# Altium schematic sheet CommitV1.0.SchDoc
size A4
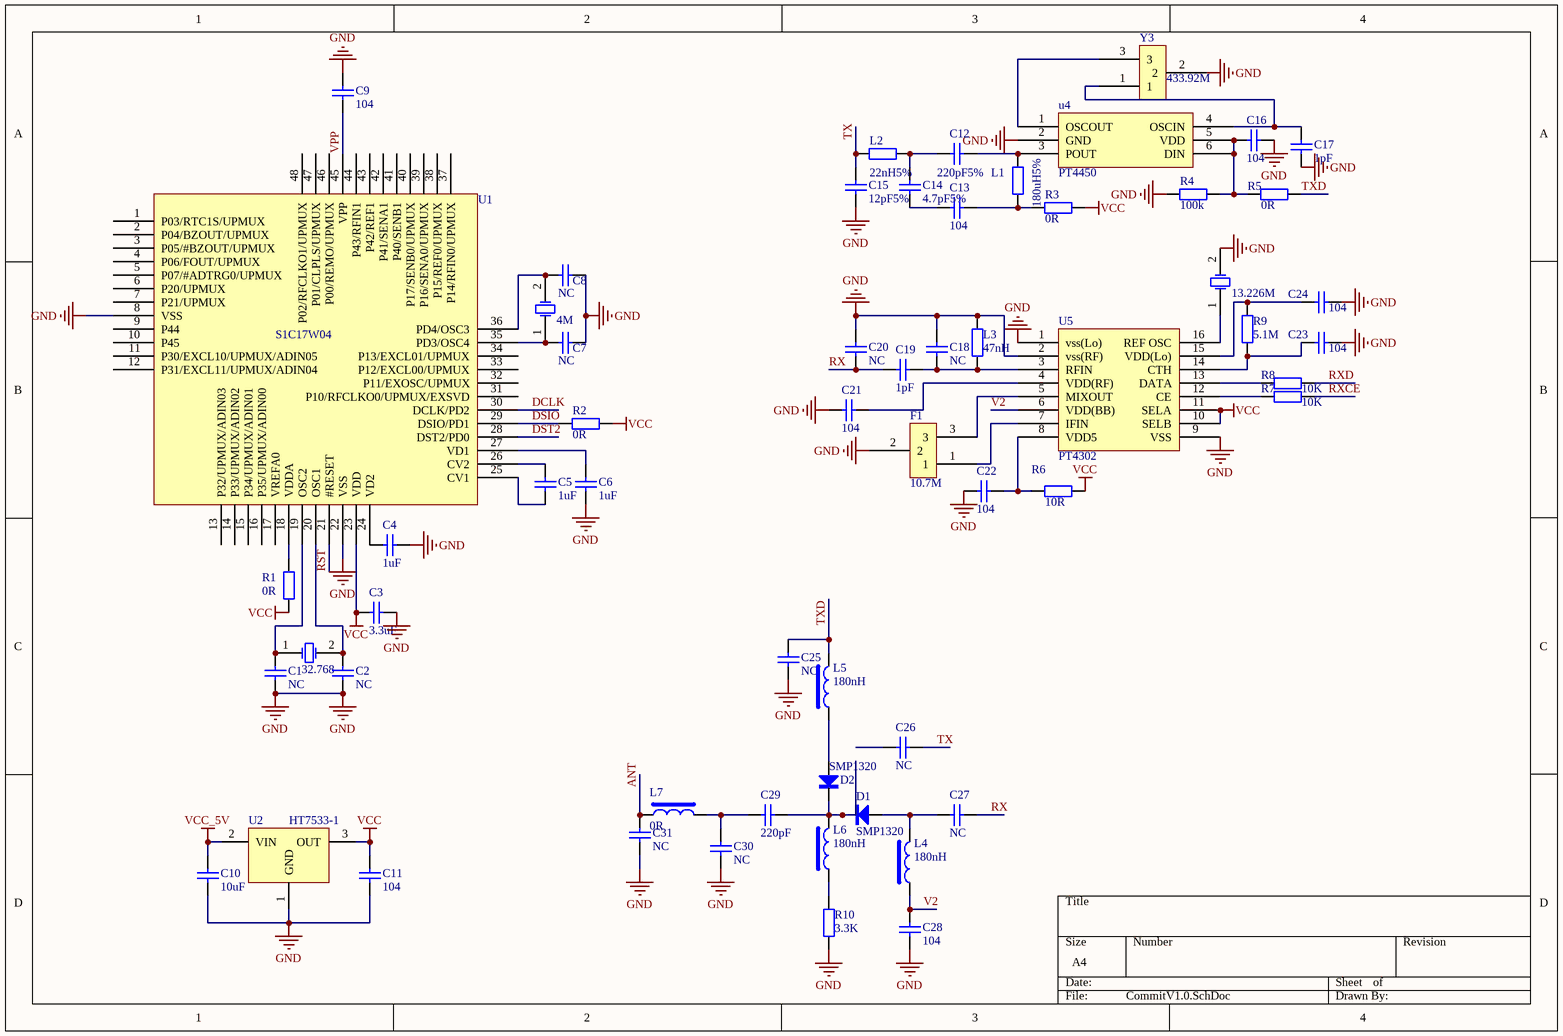
[diagram p0: CommitV1.0.SchDoc]

## Parts
C1  NC  [0603]
C2  NC  [0603]
C3  3.3uF  [0603]
C4  1uF  [0603]
C5  1uF  [0603]
C6  1uF  [0603]
C7  NC  [0603]
C8  NC  [0603]
C9  104  [0603]
C10  10uF  [0603]
C11  104  [0603]
C12  220pF5%  [0603]
C13  104  [0603]
C14  4.7pF5%  [0603]
C15  12pF5%  [0603]
C16  104  [0603]
C17  1pF  [0603]
C18  NC  [0603]
C19  1pF  [0603]
C20  NC  [0603]
C21  104  [0603]
C22  104  [0603]
C23  104  [0603]
C24  104  [0603]
C25  NC  [0603]
C26  NC  [0603]
C27  NC  [0603]
C28  104  [0603]
C29  220pF  [0603]
C30  NC  [0603]
C31  NC  [0603]
D1  SMP1320  [0603]
D2  SMP1320  [0603]
F1  10.7M  [PT4450 XTAL]
L1  180uH5%  [0603]
L2  22nH5%  [0603]
L3  47nH  [0603]
L4  180nH  [0603]
L5  180nH  [0603]
L6  180nH  [0603]
L7  0R  [0603]
R1  0R  [0603]
R2  0R  [0603]
R3  0R  [0603]
R4  100k  [0603]
R5  0R  [0603]
R6  10R  [0603]
R7  10K  [0603]
R8  10K  [0603]
R9  5.1M  [0603]
R10  3.3K  [0603]
U1  S1C17W04
U2  HT7533-1  [3A5A3D]
u4  PT4450  [PT4450]
U5  PT4302  [PT4302]
Y1  32.768  [XTAL-FC135]
Y2  4M
Y3  433.92M
Y4  13.226M  [PT4306 XTAL]

## Nets
GND: C1.1 C2.1 C3.1 C4.2 C6.2 C7.1 C8.1 C9.2 C10.2 C11.2 C15.1 C16.1 C17.2 C18.1 C20.2 C21.2 C22.2 C23.1 C24.1 C25.2 C28.1 C30.2 C31.2 F1.2 L3.2 R4.2 R10.2 U1.8(VSS) U1.22(VSS) U2.1(GND) u4.2(GND) U5.1(vss(Lo)) U5.2(vss(RF)) U5.9(VSS) Y3.2 Y4.2(OSC2)
VCC: C3.2 C11.1 R1.2 R2.1 R3.1 R6.1 U1.23(VDD) U2.3(OUT) U5.10(SELB) U5.11(SELA)
VCC_5V: C10.1 U2.2(VIN)
ANT: C31.1 L7.1
DCLK: U1.30(DCLK/PD2)
DSIO: R2.2 U1.29(DSIO/PD1)
DST2: U1.28(DST2/PD0)
RST: U1.21(#RESET)
RX: C19.1 C20.1 C27.2
RXCE: R7.1
RXD: R8.1
TX: C15.2 C26.2 L2.1
TXD: C25.1 L5.2 R5.1
V2: C28.2 L4.1 U5.6(VDD(BB))
VPP: C9.1 U1.45(VPP)
NetC1_2: C1.2 U1.19(OSC2) Y1.1(OSC1)
NetC2_2: C2.2 U1.20(OSC1) Y1.2(OSC2)
NetC4_1: C4.1 U1.24(VD2)
NetC5_1: C5.1 U1.25(CV1)
NetC5_2: C5.2 U1.26(CV2)
NetC6_1: C6.1 U1.27(VD1)
NetC7_2: C7.2 U1.35(PD3/OSC4) Y2.1(OSC1)
NetC8_2: C8.2 U1.36(PD4/OSC3) Y2.2(OSC2)
NetC12_1: C12.1 C14.2 L2.2
NetC12_2: C12.2 L1.1 u4.3(POUT)
NetC13_1: C13.1 C14.1
NetC13_2: C13.2 L1.2 R3.2
NetC16_2: C16.2 R4.1 R5.2 u4.5(VDD) u4.6(DIN)
NetC17_1: C17.1 u4.4(OSCIN) Y3.1
NetC18_2: C18.2 C19.2 L3.1 U5.3(RFIN)
NetC21_1: C21.1 U5.4(VDD(RF))
NetC22_1: C22.1 R6.2 U5.8(VDD5)
NetC23_2: C23.2 R9.2 U5.14(CTH)
NetC24_2: C24.2 R9.1 U5.15(VDD(Lo))
NetC27_1: C27.1 D1.1 L4.2
NetC29_1: C29.1 D1.2 D2.2 L6.2
NetC29_2: C29.2 C30.1 L7.2
NetD2_1: D2.1 L5.1
NetF1_1: F1.1 U5.7(IFIN)
NetF1_3: F1.3 U5.5(MIXOUT)
NetL6_1: L6.1 R10.1
NetR1_1: R1.1 U1.18(VDDA)
NetR7_2: R7.2 U5.12(CE)
NetR8_2: R8.2 U5.13(DATA)
Netu4_1: u4.1(OSCOUT) Y3.3
NetU5_16: U5.16(REF_OSC) Y4.1(OSC1)

Not connected (* = marked no-connect by the designer): C26 1; U1 1(P03/RTC1S/UPMUX) 2(P04/BZOUT/UPMUX) 3(P05/#BZOUT/UPMUX) 4(P06/FOUT/UPMUX) 5(P07/#ADTRG0/UPMUX) 6(P20/UPMUX) 7(P21/UPMUX) 9(P44) 10(P45) 11(P30/EXCL10/UPMUX/ADIN05) 12(P31/EXCL11/UPMUX/ADIN04) 13(P32/UPMUX/ADIN03) 14(P33/UPMUX/ADIN02) 15(P34/UPMUX/ADIN01) 16(P35/UPMUX/ADIN00) 17(VREFA0) 31(P10/RFCLKO0/UPMUX/EXSVD) 32(P11/EXOSC/UPMUX) 33(P12/EXCL00/UPMUX) 34(P13/EXCL01/UPMUX) 37(P14/RFIN0/UPMUX) 38(P15/REF0/UPMUX) 39(P16/SENA0/UPMUX) 40(P17/SENB0/UPMUX) 41(P40/SENB1) 42(P41/SENA1) 43(P42/REF1) 44(P43/RFIN1) 46(P00/REMO/UPMUX) 47(P01/CLPLS/UPMUX) 48(P02/RFCLKO1/UPMUX)

## Library data of the parts
C1-C31 = Cap: Capacitor; Published: 8-Jun-2000; LatestRevisionDate: 17-Jul-2002; LatestRevisionNote: Re-released for DXP Platform.; PackageReference: RAD-0.3; Publisher: Altium Limited
D1 D2 = DIODE
F1 = Filter
L1-L3 R1-R10 = Res2: Resistor; Published: 8-Jun-2000; LatestRevisionDate: 17-Jul-2002; LatestRevisionNote: Re-released for DXP Platform.; PackageReference: AXIAL-0.4; Publisher: Altium Limited
L4-L7 = L: Inductor
U1 = TQFP12-48PIN
Y1 Y2 Y4 = XTAL: Crystal Oscillator
Y3 = PT4450-XTAL